# EAGLE schematic harp behavior poke port breakout v2.1 (EAGLE 9.5.1)
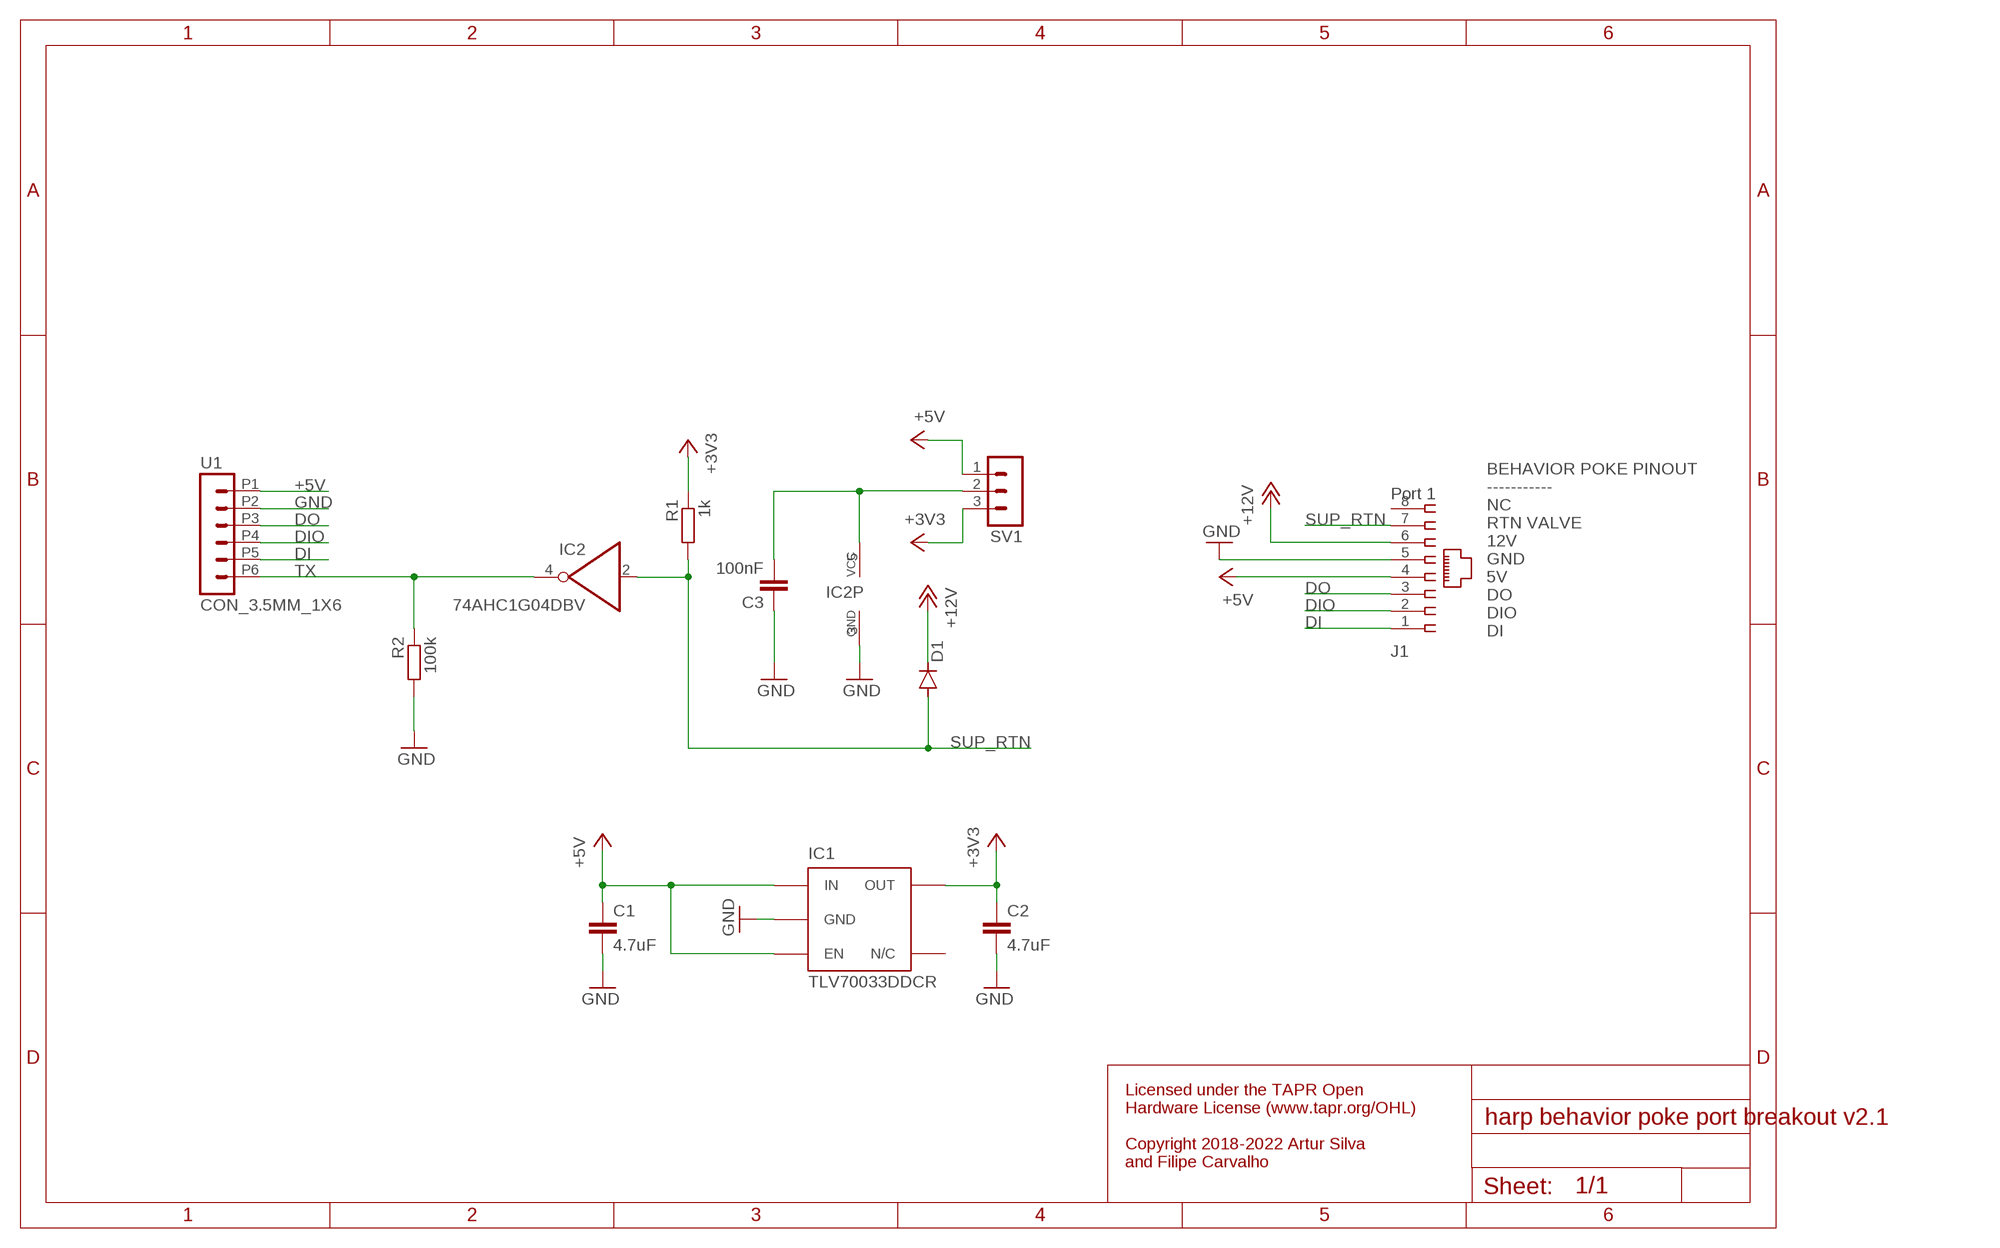
[diagram p0: schematic, sheet 1]

## Parts
C1  4.7uF  C-EUC0603  [C0603]
C2  4.7uF  C-EUC0603  [C0603]
C3  100nF  C-EUC0402  [C0402]
D1  DIODE  [SOD-323-DIODE]
IC1  TLV70033DDCR  TLV700XX  [TSOT23-5]
IC2  74AHC1G04DBV  [SOT23-5]
J1  Port 1  520426-4  [520426-4]
R1  1k  R-EU_R0402  [R0402]
R2  100k  R-EU_R0402  [R0402]
SV1  MA03-1  [MA03-1]
U1  CON_3.5MM_1X6  [CON_3.5MM_1X6]

## Nets
+3V3: C2.1 IC1.5(OUT) R1.1 SV1.3
+5V: C1.1 IC1.1(IN) IC1.3(EN) J1.4 SV1.1 U1.P1
+12V: D1.C J1.6
DI: J1.1 U1.P5
DIO: J1.2 U1.P4
DO: J1.3 U1.P3
GND: C1.2 C2.2 C3.1 IC1.2(GND) IC2.3(GND) J1.5 R2.2 U1.P2
N$2: C3.2 IC2.5(VCC) SV1.2
SUP_RTN: D1.A IC2.2(I) J1.7 R1.2
TX: IC2.4(O) R2.1 U1.P6
Unconnected: IC1.4(N/C) J1.8

## Notes on the sheet
- BEHAVIOR POKE PINOUT
  -----------
  NC
  RTN VALVE
  12V
  GND
  5V
  DO
  DIO
  DI
- Licensed under the TAPR Open 
  Hardware License (www.tapr.org/OHL)
  
  Copyright 2018-2022 Artur Silva 
  and Filipe Carvalho

## Library data of the parts
C1-C3 = rcl:C-EU: CAPACITOR, European symbol
D1 = CNP-miscellaneous:DIODE
IC1 = CNP:TLV700XX
IC2 = 74xx-little-de:74*1G04: INVERTER Gate
J1 = con-amp:520426-4: AMP connector
R1 R2 = rcl:R-EU_: RESISTOR, European symbol
SV1 = con-lstb:MA03-1: PIN HEADER; OC_FARNELL: unknown; OC_NEWARK: unknown
U1 = CNP-connectors:CON_3.5MM_1X6